# Altium schematic sheet Keypad.SchDoc
size A; Organization: Altium Limited; Address1: L3, 12a Rodborough Rd; Address2: Frenchs Forest; Address3: NSW; Address4: Australia 2086; DocumentNumber: 1; SheetNumber: 1; SheetTotal: 3
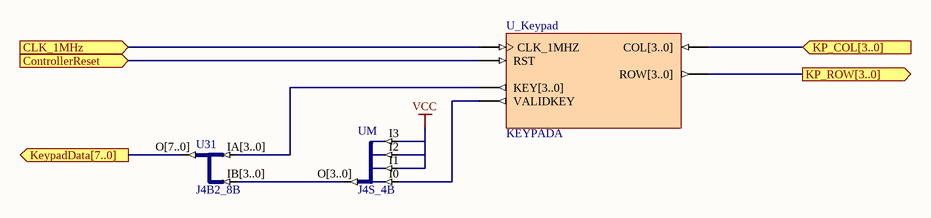
[diagram p0: Keypad.SchDoc]

## Parts
U31  J4B2_8B
U_Keypad  KEYPADA
UM  J4S_4B

## Ports
CLK_1MHz (in), ControllerReset (in), KeypadData[7..0] (out), KP_COL[3..0] (in), KP_ROW[3..0] (out)

## Nets
VCC: UM.I1 UM.I2 UM.I3
CLK_1MHz: U_Keypad.CLK_1MHZ ; port CLK_1MHz
ControllerReset: U_Keypad.RST ; port ControllerReset
KeypadData[7..0]: U31.O[7..0] ; port KeypadData[7..0]
KP_COL[3..0]: U_Keypad.COL[3..0] ; port KP_COL[3..0]
KP_ROW[3..0]: U_Keypad.ROW[3..0] ; port KP_ROW[3..0]
NetU31_IA[3..0]: U31.IA[3..0] U_Keypad.KEY[3..0]
NetU31_IB[3..0]: U31.IB[3..0] UM.O[3..0]
NetU_Keypad_VALIDKEY: U_Keypad.VALIDKEY UM.I0

## Notes on the sheet
- Title
- Size:
- Date:
- A
- Number:
- Time:
- Revision:
- Sheet
- of
- File:

## Library data of the parts
U31 = J4B2_8B: 2 x 4-Bit input bus to 1 x 8-bit output bus; ArchiveName: GENERIC; Published: 18-Dec-2003; Publisher: Altium Limited; Core Revision: 1.00.00
U_Keypad = KEYPADA: Keypad; Published: 2/01/2004; Publisher: Altium Hobart Technology Centre; Core Revision: 1.00.00
UM = J4S_4B: 4 Single pin inputs to single 4-Bit output bus; ArchiveName: GENERIC; Published: 18-Dec-2003; Publisher: Altium Limited; Core Revision: 1.00.00